# Altium project PCB_Project.PrjPcb
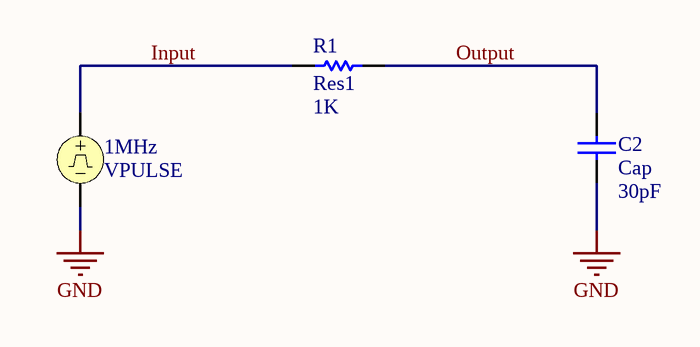
[diagram p0: Sheet1.SchDoc]
3 sheets, 11 parts. Net scope: global (net labels, ports and power ports of the same name join across sheets).
Sheets:
  Sheet1.SchDoc
  Sheet2.SchDoc
  Sheet3.SchDoc

## Sheet Sheet1.SchDoc
size A

### Parts
(Parts that share a designator on the sheet are numbered #1, #2 ... from top to bottom, then left to right.)
1MHz#1  VPULSE
C2#1  Cap  value 30pF  [RAD-0.3]
R1#1  Res1  value 1K  [AXIAL-0.3]

### Nets
GND: 1MHz#1.2 C2#1.1
Input: 1MHz#1.1 R1#1.2
Output: C2#1.2 R1#1.1

### Library data of the parts
1MHz#1 = VPULSE: Pulse Voltage Source; Note: PCB Footprint - Not required; Published: 8-Jun-2000; LatestRevisionDate: 15-Nov-2004; LatestRevisionNote: Corrected Netlist.; PackageReference: Not Applicable; Publisher: Altium Limited
C2#1 = Cap: Capacitor; Manufacturer: Generic Components; Class: Passive; Published: 08/06/2000; Publisher: Altium Hobart Technology Centre; SubClass: Capacitor
R1#1 = Res1: Resistor; Manufacturer: Generic Components; Class: Passive; Published: 08/06/2000; Publisher: Altium Hobart Technology Centre; SubClass: Resistor

## Sheet Sheet2.SchDoc
size A
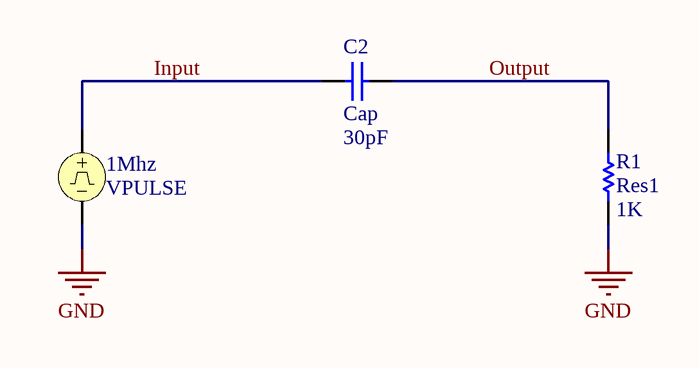
[diagram p1: Sheet2.SchDoc]

### Parts
(Parts that share a designator on the sheet are numbered #1, #2 ... from top to bottom, then left to right.)
1Mhz#2  VPULSE
C2#2  Cap  value 30pF  [RAD-0.3]
R1#2  Res1  value 1K  [AXIAL-0.3]

### Nets
GND: 1Mhz#2.2 R1#2.2
Input: 1Mhz#2.1 C2#2.2
Output: C2#2.1 R1#2.1

### Library data of the parts
1Mhz#2 = VPULSE: as 1MHz#1 on sheet Sheet1; Published: 8-Jun-2000; LatestRevisionDate: 15-Nov-2004; LatestRevisionNote: Corrected Netlist.; PackageReference: Not Applicable; Publisher: Altium Limited
C2#2 = Cap: as C2#1 on sheet Sheet1; Published: 08/06/2000; Publisher: Altium Hobart Technology Centre; SubClass: Capacitor
R1#2 = Res1: as R1#1 on sheet Sheet1; Published: 08/06/2000; Publisher: Altium Hobart Technology Centre; SubClass: Resistor

## Sheet Sheet3.SchDoc
size A
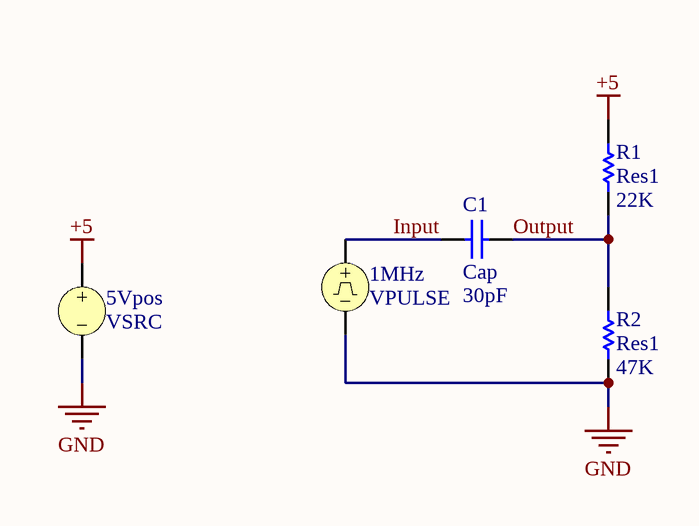
[diagram p2: Sheet3.SchDoc]

### Parts
(Parts that share a designator on the sheet are numbered #1, #2 ... from top to bottom, then left to right.)
1MHz#3  VPULSE
5Vpos  VSRC
C1  Cap  value 30pF  [RAD-0.3]
R1#3  Res1  value 22K  [AXIAL-0.3]
R2  Res1  value 47K  [AXIAL-0.3]

### Nets
+5: 5Vpos.1 R1#3.2
GND: 1MHz#3.2 5Vpos.2 R2.1
Input: 1MHz#3.1 C1.1
Output: C1.2 R1#3.1 R2.2

### Library data of the parts
1MHz#3 = VPULSE: as 1MHz#1 on sheet Sheet1; Published: 8-Jun-2000; LatestRevisionDate: 15-Nov-2004; LatestRevisionNote: Corrected Netlist.; PackageReference: Not Applicable; Publisher: Altium Limited
5Vpos = VSRC: Voltage Source; Note: PCB Footprint - Not required; Value: +5; Published: 8-Jun-2000; LatestRevisionDate: 17-Jul-2002; LatestRevisionNote: Re-released for DXP Platform.; PackageReference: Not Applicable; Publisher: Altium Limited
C1 = Cap: as C2#1 on sheet Sheet1; Published: 08/06/2000; Publisher: Altium Hobart Technology Centre; SubClass: Capacitor
R1#3 R2 = Res1: as R1#1 on sheet Sheet1; Published: 08/06/2000; Publisher: Altium Hobart Technology Centre; SubClass: Resistor

## Nets that join several sheets
GND: Sheet1 (1MHz#1.2 C2#1.1), Sheet2 (1Mhz#2.2 R1#2.2), Sheet3 (1MHz#3.2 5Vpos.2 R2.1)
Input: Sheet1 (1MHz#1.1 R1#1.2), Sheet2 (1Mhz#2.1 C2#2.2), Sheet3 (1MHz#3.1 C1.1)
Output: Sheet1 (C2#1.2 R1#1.1), Sheet2 (C2#2.1 R1#2.1), Sheet3 (C1.2 R1#3.1 R2.2)